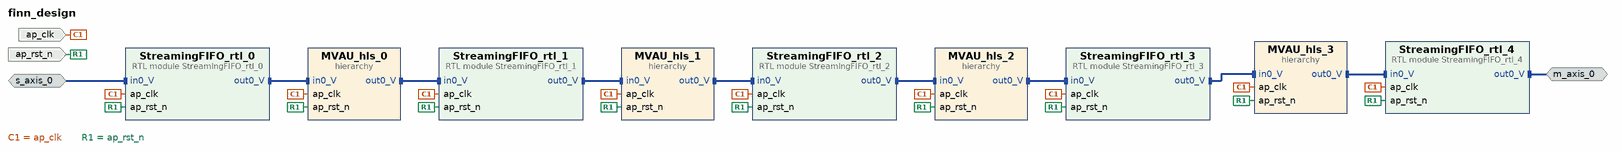
[diagram p0: block diagram of the top level]
# Vivado block design finn_design, xc7z020clg400-1, Vivado 2022.2
create_bd_design finn_design

create_bd_intf_port -mode Slave -vlnv xilinx.com:interface:axis_rtl:1.0 s_axis_0
set_property -dict [list \
  CONFIG.HAS_TKEEP 0 \
  CONFIG.HAS_TLAST 0 \
  CONFIG.HAS_TREADY 1 \
  CONFIG.HAS_TSTRB 0 \
  CONFIG.LAYERED_METADATA undef \
  CONFIG.TDATA_NUM_BYTES 1 \
  CONFIG.TDEST_WIDTH 0 \
  CONFIG.TID_WIDTH 0 \
  CONFIG.TUSER_WIDTH 0 \
] [get_bd_intf_ports s_axis_0]
create_bd_intf_port -mode Master -vlnv xilinx.com:interface:axis_rtl:1.0 m_axis_0
create_bd_port -dir I -type clk ap_clk
set_property -dict {CONFIG.FREQ_HZ 100000000} [get_bd_ports ap_clk]
create_bd_port -dir I -type rst ap_rst_n

create_bd_cell -type module -reference StreamingFIFO_rtl_0 StreamingFIFO_rtl_0
create_bd_cell -type hier MVAU_hls_0
create_bd_cell -type module -reference StreamingFIFO_rtl_1 StreamingFIFO_rtl_1
create_bd_cell -type hier MVAU_hls_1
create_bd_cell -type module -reference StreamingFIFO_rtl_2 StreamingFIFO_rtl_2
create_bd_cell -type hier MVAU_hls_2
create_bd_cell -type module -reference StreamingFIFO_rtl_3 StreamingFIFO_rtl_3
create_bd_cell -type hier MVAU_hls_3
create_bd_cell -type module -reference StreamingFIFO_rtl_4 StreamingFIFO_rtl_4

# ---- hierarchy /MVAU_hls_0 ----
current_bd_instance /MVAU_hls_0
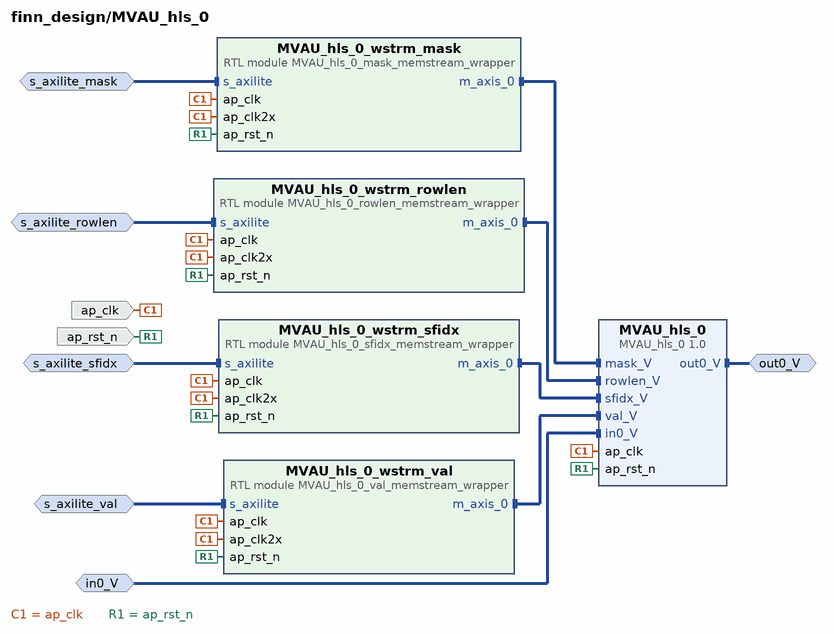
[diagram p1: block diagram inside /MVAU_hls_0]
create_bd_intf_pin -mode Master -vlnv xilinx.com:interface:axis_rtl:1.0 out0_V
create_bd_intf_pin -mode Slave -vlnv xilinx.com:interface:axis_rtl:1.0 in0_V
create_bd_intf_pin -mode Slave -vlnv xilinx.com:interface:aximm_rtl:1.0 s_axilite_sfidx
create_bd_intf_pin -mode Slave -vlnv xilinx.com:interface:aximm_rtl:1.0 s_axilite_val
create_bd_intf_pin -mode Slave -vlnv xilinx.com:interface:aximm_rtl:1.0 s_axilite_mask
create_bd_intf_pin -mode Slave -vlnv xilinx.com:interface:aximm_rtl:1.0 s_axilite_rowlen
create_bd_pin -dir I -type clk ap_clk
create_bd_pin -dir I -type rst ap_rst_n

create_bd_cell -type ip -vlnv xilinx.com:hls:MVAU_hls_0:1.0 MVAU_hls_0
create_bd_cell -type module -reference MVAU_hls_0_sfidx_memstream_wrapper MVAU_hls_0_wstrm_sfidx
create_bd_cell -type module -reference MVAU_hls_0_val_memstream_wrapper MVAU_hls_0_wstrm_val
create_bd_cell -type module -reference MVAU_hls_0_mask_memstream_wrapper MVAU_hls_0_wstrm_mask
create_bd_cell -type module -reference MVAU_hls_0_rowlen_memstream_wrapper MVAU_hls_0_wstrm_rowlen

# ---- hierarchy /MVAU_hls_1 ----
current_bd_instance /MVAU_hls_1
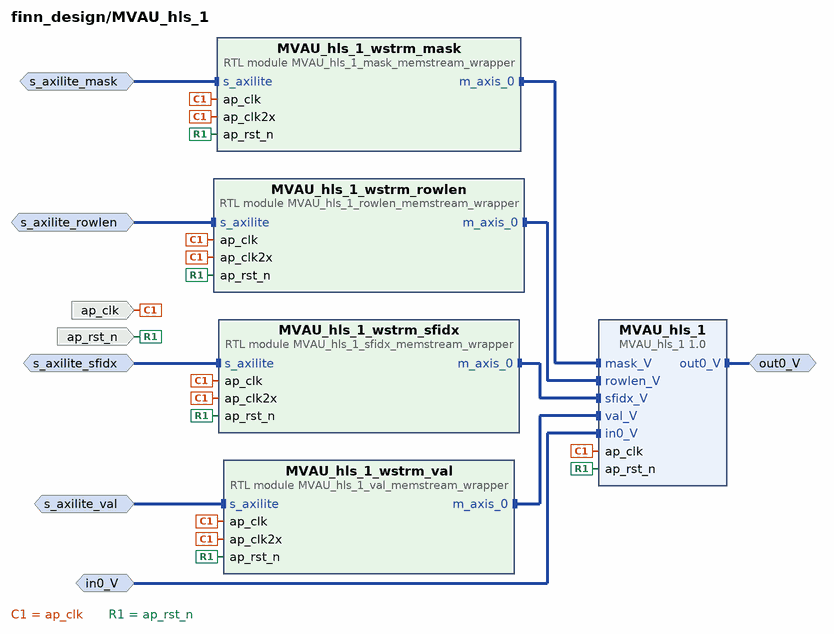
[diagram p2: block diagram inside /MVAU_hls_1]
create_bd_intf_pin -mode Master -vlnv xilinx.com:interface:axis_rtl:1.0 out0_V
create_bd_intf_pin -mode Slave -vlnv xilinx.com:interface:axis_rtl:1.0 in0_V
create_bd_intf_pin -mode Slave -vlnv xilinx.com:interface:aximm_rtl:1.0 s_axilite_sfidx
create_bd_intf_pin -mode Slave -vlnv xilinx.com:interface:aximm_rtl:1.0 s_axilite_val
create_bd_intf_pin -mode Slave -vlnv xilinx.com:interface:aximm_rtl:1.0 s_axilite_mask
create_bd_intf_pin -mode Slave -vlnv xilinx.com:interface:aximm_rtl:1.0 s_axilite_rowlen
create_bd_pin -dir I -type clk ap_clk
create_bd_pin -dir I -type rst ap_rst_n

create_bd_cell -type ip -vlnv xilinx.com:hls:MVAU_hls_1:1.0 MVAU_hls_1
create_bd_cell -type module -reference MVAU_hls_1_sfidx_memstream_wrapper MVAU_hls_1_wstrm_sfidx
create_bd_cell -type module -reference MVAU_hls_1_val_memstream_wrapper MVAU_hls_1_wstrm_val
create_bd_cell -type module -reference MVAU_hls_1_mask_memstream_wrapper MVAU_hls_1_wstrm_mask
create_bd_cell -type module -reference MVAU_hls_1_rowlen_memstream_wrapper MVAU_hls_1_wstrm_rowlen

# ---- hierarchy /MVAU_hls_2 ----
current_bd_instance /MVAU_hls_2
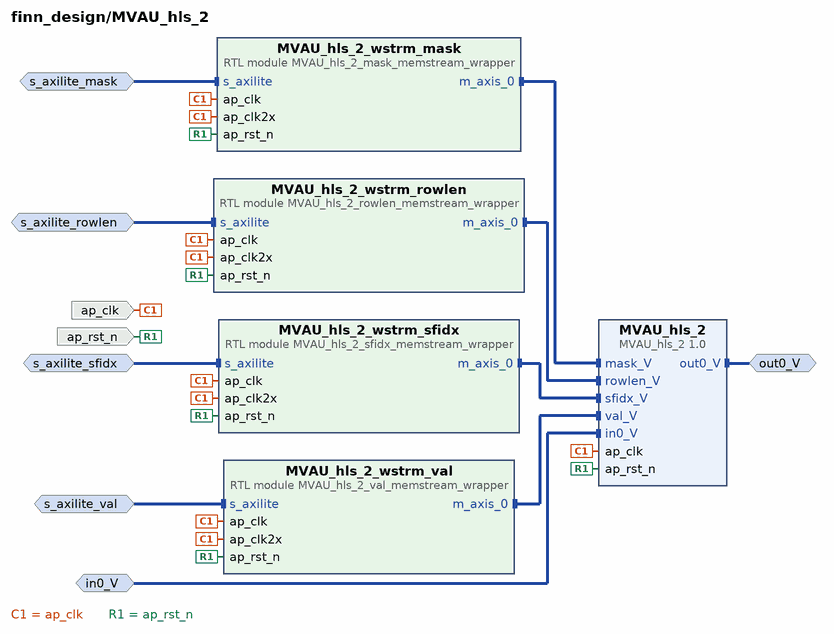
[diagram p3: block diagram inside /MVAU_hls_2]
create_bd_intf_pin -mode Master -vlnv xilinx.com:interface:axis_rtl:1.0 out0_V
create_bd_intf_pin -mode Slave -vlnv xilinx.com:interface:axis_rtl:1.0 in0_V
create_bd_intf_pin -mode Slave -vlnv xilinx.com:interface:aximm_rtl:1.0 s_axilite_sfidx
create_bd_intf_pin -mode Slave -vlnv xilinx.com:interface:aximm_rtl:1.0 s_axilite_val
create_bd_intf_pin -mode Slave -vlnv xilinx.com:interface:aximm_rtl:1.0 s_axilite_mask
create_bd_intf_pin -mode Slave -vlnv xilinx.com:interface:aximm_rtl:1.0 s_axilite_rowlen
create_bd_pin -dir I -type clk ap_clk
create_bd_pin -dir I -type rst ap_rst_n

create_bd_cell -type ip -vlnv xilinx.com:hls:MVAU_hls_2:1.0 MVAU_hls_2
create_bd_cell -type module -reference MVAU_hls_2_sfidx_memstream_wrapper MVAU_hls_2_wstrm_sfidx
create_bd_cell -type module -reference MVAU_hls_2_val_memstream_wrapper MVAU_hls_2_wstrm_val
create_bd_cell -type module -reference MVAU_hls_2_mask_memstream_wrapper MVAU_hls_2_wstrm_mask
create_bd_cell -type module -reference MVAU_hls_2_rowlen_memstream_wrapper MVAU_hls_2_wstrm_rowlen

# ---- hierarchy /MVAU_hls_3 ----
current_bd_instance /MVAU_hls_3
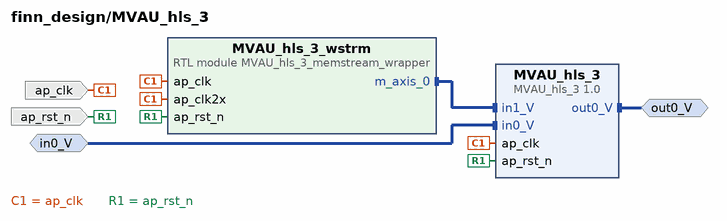
[diagram p4: block diagram inside /MVAU_hls_3]
create_bd_intf_pin -mode Master -vlnv xilinx.com:interface:axis_rtl:1.0 out0_V
create_bd_intf_pin -mode Slave -vlnv xilinx.com:interface:axis_rtl:1.0 in0_V
create_bd_pin -dir I -type clk ap_clk
create_bd_pin -dir I -type rst ap_rst_n

create_bd_cell -type ip -vlnv xilinx.com:hls:MVAU_hls_3:1.0 MVAU_hls_3
create_bd_cell -type module -reference MVAU_hls_3_memstream_wrapper MVAU_hls_3_wstrm

# ---- connections ----

current_bd_instance /MVAU_hls_0
connect_bd_intf_net [get_bd_intf_pins out0_V] [get_bd_intf_pins MVAU_hls_0/out0_V]
connect_bd_intf_net [get_bd_intf_pins MVAU_hls_0_wstrm_mask/m_axis_0] [get_bd_intf_pins MVAU_hls_0/mask_V]
connect_bd_intf_net [get_bd_intf_pins MVAU_hls_0_wstrm_rowlen/m_axis_0] [get_bd_intf_pins MVAU_hls_0/rowlen_V]
connect_bd_intf_net [get_bd_intf_pins MVAU_hls_0_wstrm_sfidx/m_axis_0] [get_bd_intf_pins MVAU_hls_0/sfidx_V]
connect_bd_intf_net [get_bd_intf_pins MVAU_hls_0_wstrm_val/m_axis_0] [get_bd_intf_pins MVAU_hls_0/val_V]
connect_bd_intf_net [get_bd_intf_pins in0_V] [get_bd_intf_pins MVAU_hls_0/in0_V]
connect_bd_intf_net [get_bd_intf_pins s_axilite_mask] [get_bd_intf_pins MVAU_hls_0_wstrm_mask/s_axilite]
connect_bd_intf_net [get_bd_intf_pins s_axilite_rowlen] [get_bd_intf_pins MVAU_hls_0_wstrm_rowlen/s_axilite]
connect_bd_intf_net [get_bd_intf_pins s_axilite_sfidx] [get_bd_intf_pins MVAU_hls_0_wstrm_sfidx/s_axilite]
connect_bd_intf_net [get_bd_intf_pins s_axilite_val] [get_bd_intf_pins MVAU_hls_0_wstrm_val/s_axilite]
connect_bd_net [get_bd_pins ap_clk] \
  [get_bd_pins MVAU_hls_0/ap_clk] [get_bd_pins MVAU_hls_0_wstrm_sfidx/ap_clk] [get_bd_pins MVAU_hls_0_wstrm_sfidx/ap_clk2x] \
  [get_bd_pins MVAU_hls_0_wstrm_val/ap_clk] [get_bd_pins MVAU_hls_0_wstrm_val/ap_clk2x] \
  [get_bd_pins MVAU_hls_0_wstrm_mask/ap_clk] [get_bd_pins MVAU_hls_0_wstrm_mask/ap_clk2x] \
  [get_bd_pins MVAU_hls_0_wstrm_rowlen/ap_clk] [get_bd_pins MVAU_hls_0_wstrm_rowlen/ap_clk2x]
connect_bd_net [get_bd_pins ap_rst_n] \
  [get_bd_pins MVAU_hls_0/ap_rst_n] [get_bd_pins MVAU_hls_0_wstrm_sfidx/ap_rst_n] [get_bd_pins MVAU_hls_0_wstrm_val/ap_rst_n] \
  [get_bd_pins MVAU_hls_0_wstrm_mask/ap_rst_n] [get_bd_pins MVAU_hls_0_wstrm_rowlen/ap_rst_n]

current_bd_instance /MVAU_hls_1
connect_bd_intf_net [get_bd_intf_pins out0_V] [get_bd_intf_pins MVAU_hls_1/out0_V]
connect_bd_intf_net [get_bd_intf_pins MVAU_hls_1_wstrm_mask/m_axis_0] [get_bd_intf_pins MVAU_hls_1/mask_V]
connect_bd_intf_net [get_bd_intf_pins MVAU_hls_1_wstrm_rowlen/m_axis_0] [get_bd_intf_pins MVAU_hls_1/rowlen_V]
connect_bd_intf_net [get_bd_intf_pins MVAU_hls_1_wstrm_sfidx/m_axis_0] [get_bd_intf_pins MVAU_hls_1/sfidx_V]
connect_bd_intf_net [get_bd_intf_pins MVAU_hls_1_wstrm_val/m_axis_0] [get_bd_intf_pins MVAU_hls_1/val_V]
connect_bd_intf_net [get_bd_intf_pins in0_V] [get_bd_intf_pins MVAU_hls_1/in0_V]
connect_bd_intf_net [get_bd_intf_pins s_axilite_mask] [get_bd_intf_pins MVAU_hls_1_wstrm_mask/s_axilite]
connect_bd_intf_net [get_bd_intf_pins s_axilite_rowlen] [get_bd_intf_pins MVAU_hls_1_wstrm_rowlen/s_axilite]
connect_bd_intf_net [get_bd_intf_pins s_axilite_sfidx] [get_bd_intf_pins MVAU_hls_1_wstrm_sfidx/s_axilite]
connect_bd_intf_net [get_bd_intf_pins s_axilite_val] [get_bd_intf_pins MVAU_hls_1_wstrm_val/s_axilite]
connect_bd_net [get_bd_pins ap_clk] \
  [get_bd_pins MVAU_hls_1/ap_clk] [get_bd_pins MVAU_hls_1_wstrm_sfidx/ap_clk] [get_bd_pins MVAU_hls_1_wstrm_sfidx/ap_clk2x] \
  [get_bd_pins MVAU_hls_1_wstrm_val/ap_clk] [get_bd_pins MVAU_hls_1_wstrm_val/ap_clk2x] \
  [get_bd_pins MVAU_hls_1_wstrm_mask/ap_clk] [get_bd_pins MVAU_hls_1_wstrm_mask/ap_clk2x] \
  [get_bd_pins MVAU_hls_1_wstrm_rowlen/ap_clk] [get_bd_pins MVAU_hls_1_wstrm_rowlen/ap_clk2x]
connect_bd_net [get_bd_pins ap_rst_n] \
  [get_bd_pins MVAU_hls_1/ap_rst_n] [get_bd_pins MVAU_hls_1_wstrm_sfidx/ap_rst_n] [get_bd_pins MVAU_hls_1_wstrm_val/ap_rst_n] \
  [get_bd_pins MVAU_hls_1_wstrm_mask/ap_rst_n] [get_bd_pins MVAU_hls_1_wstrm_rowlen/ap_rst_n]

current_bd_instance /MVAU_hls_2
connect_bd_intf_net [get_bd_intf_pins out0_V] [get_bd_intf_pins MVAU_hls_2/out0_V]
connect_bd_intf_net [get_bd_intf_pins MVAU_hls_2_wstrm_mask/m_axis_0] [get_bd_intf_pins MVAU_hls_2/mask_V]
connect_bd_intf_net [get_bd_intf_pins MVAU_hls_2_wstrm_rowlen/m_axis_0] [get_bd_intf_pins MVAU_hls_2/rowlen_V]
connect_bd_intf_net [get_bd_intf_pins MVAU_hls_2_wstrm_sfidx/m_axis_0] [get_bd_intf_pins MVAU_hls_2/sfidx_V]
connect_bd_intf_net [get_bd_intf_pins MVAU_hls_2_wstrm_val/m_axis_0] [get_bd_intf_pins MVAU_hls_2/val_V]
connect_bd_intf_net [get_bd_intf_pins in0_V] [get_bd_intf_pins MVAU_hls_2/in0_V]
connect_bd_intf_net [get_bd_intf_pins s_axilite_mask] [get_bd_intf_pins MVAU_hls_2_wstrm_mask/s_axilite]
connect_bd_intf_net [get_bd_intf_pins s_axilite_rowlen] [get_bd_intf_pins MVAU_hls_2_wstrm_rowlen/s_axilite]
connect_bd_intf_net [get_bd_intf_pins s_axilite_sfidx] [get_bd_intf_pins MVAU_hls_2_wstrm_sfidx/s_axilite]
connect_bd_intf_net [get_bd_intf_pins s_axilite_val] [get_bd_intf_pins MVAU_hls_2_wstrm_val/s_axilite]
connect_bd_net [get_bd_pins ap_clk] \
  [get_bd_pins MVAU_hls_2/ap_clk] [get_bd_pins MVAU_hls_2_wstrm_sfidx/ap_clk] [get_bd_pins MVAU_hls_2_wstrm_sfidx/ap_clk2x] \
  [get_bd_pins MVAU_hls_2_wstrm_val/ap_clk] [get_bd_pins MVAU_hls_2_wstrm_val/ap_clk2x] \
  [get_bd_pins MVAU_hls_2_wstrm_mask/ap_clk] [get_bd_pins MVAU_hls_2_wstrm_mask/ap_clk2x] \
  [get_bd_pins MVAU_hls_2_wstrm_rowlen/ap_clk] [get_bd_pins MVAU_hls_2_wstrm_rowlen/ap_clk2x]
connect_bd_net [get_bd_pins ap_rst_n] \
  [get_bd_pins MVAU_hls_2/ap_rst_n] [get_bd_pins MVAU_hls_2_wstrm_sfidx/ap_rst_n] [get_bd_pins MVAU_hls_2_wstrm_val/ap_rst_n] \
  [get_bd_pins MVAU_hls_2_wstrm_mask/ap_rst_n] [get_bd_pins MVAU_hls_2_wstrm_rowlen/ap_rst_n]

current_bd_instance /MVAU_hls_3
connect_bd_intf_net [get_bd_intf_pins out0_V] [get_bd_intf_pins MVAU_hls_3/out0_V]
connect_bd_intf_net [get_bd_intf_pins MVAU_hls_3_wstrm/m_axis_0] [get_bd_intf_pins MVAU_hls_3/in1_V]
connect_bd_intf_net [get_bd_intf_pins in0_V] [get_bd_intf_pins MVAU_hls_3/in0_V]
connect_bd_net [get_bd_pins ap_clk] [get_bd_pins MVAU_hls_3/ap_clk] [get_bd_pins MVAU_hls_3_wstrm/ap_clk] [get_bd_pins MVAU_hls_3_wstrm/ap_clk2x]
connect_bd_net [get_bd_pins ap_rst_n] [get_bd_pins MVAU_hls_3/ap_rst_n] [get_bd_pins MVAU_hls_3_wstrm/ap_rst_n]

current_bd_instance /
connect_bd_intf_net [get_bd_intf_pins MVAU_hls_0/out0_V] [get_bd_intf_pins StreamingFIFO_rtl_1/in0_V]
connect_bd_intf_net [get_bd_intf_pins MVAU_hls_1/out0_V] [get_bd_intf_pins StreamingFIFO_rtl_2/in0_V]
connect_bd_intf_net [get_bd_intf_pins MVAU_hls_2/out0_V] [get_bd_intf_pins StreamingFIFO_rtl_3/in0_V]
connect_bd_intf_net [get_bd_intf_pins MVAU_hls_3/out0_V] [get_bd_intf_pins StreamingFIFO_rtl_4/in0_V]
connect_bd_intf_net [get_bd_intf_pins StreamingFIFO_rtl_0/out0_V] [get_bd_intf_pins MVAU_hls_0/in0_V]
connect_bd_intf_net [get_bd_intf_pins StreamingFIFO_rtl_1/out0_V] [get_bd_intf_pins MVAU_hls_1/in0_V]
connect_bd_intf_net [get_bd_intf_pins StreamingFIFO_rtl_2/out0_V] [get_bd_intf_pins MVAU_hls_2/in0_V]
connect_bd_intf_net [get_bd_intf_pins StreamingFIFO_rtl_3/out0_V] [get_bd_intf_pins MVAU_hls_3/in0_V]
connect_bd_intf_net [get_bd_intf_ports m_axis_0] [get_bd_intf_pins StreamingFIFO_rtl_4/out0_V]
connect_bd_intf_net -intf_net in0_V_0_1 [get_bd_intf_ports s_axis_0] [get_bd_intf_pins StreamingFIFO_rtl_0/in0_V]
connect_bd_net -net ap_clk_0_1 [get_bd_ports ap_clk] \
  [get_bd_pins StreamingFIFO_rtl_0/ap_clk] [get_bd_pins MVAU_hls_0/ap_clk] [get_bd_pins StreamingFIFO_rtl_1/ap_clk] \
  [get_bd_pins MVAU_hls_1/ap_clk] [get_bd_pins StreamingFIFO_rtl_2/ap_clk] [get_bd_pins MVAU_hls_2/ap_clk] \
  [get_bd_pins StreamingFIFO_rtl_3/ap_clk] [get_bd_pins MVAU_hls_3/ap_clk] [get_bd_pins StreamingFIFO_rtl_4/ap_clk]
connect_bd_net -net ap_rst_n_0_1 [get_bd_ports ap_rst_n] \
  [get_bd_pins StreamingFIFO_rtl_0/ap_rst_n] [get_bd_pins MVAU_hls_0/ap_rst_n] [get_bd_pins StreamingFIFO_rtl_1/ap_rst_n] \
  [get_bd_pins MVAU_hls_1/ap_rst_n] [get_bd_pins StreamingFIFO_rtl_2/ap_rst_n] [get_bd_pins MVAU_hls_2/ap_rst_n] \
  [get_bd_pins StreamingFIFO_rtl_3/ap_rst_n] [get_bd_pins MVAU_hls_3/ap_rst_n] [get_bd_pins StreamingFIFO_rtl_4/ap_rst_n]

validate_bd_design
save_bd_design
